# EAGLE schematic EMG (EAGLE 8.6.0)
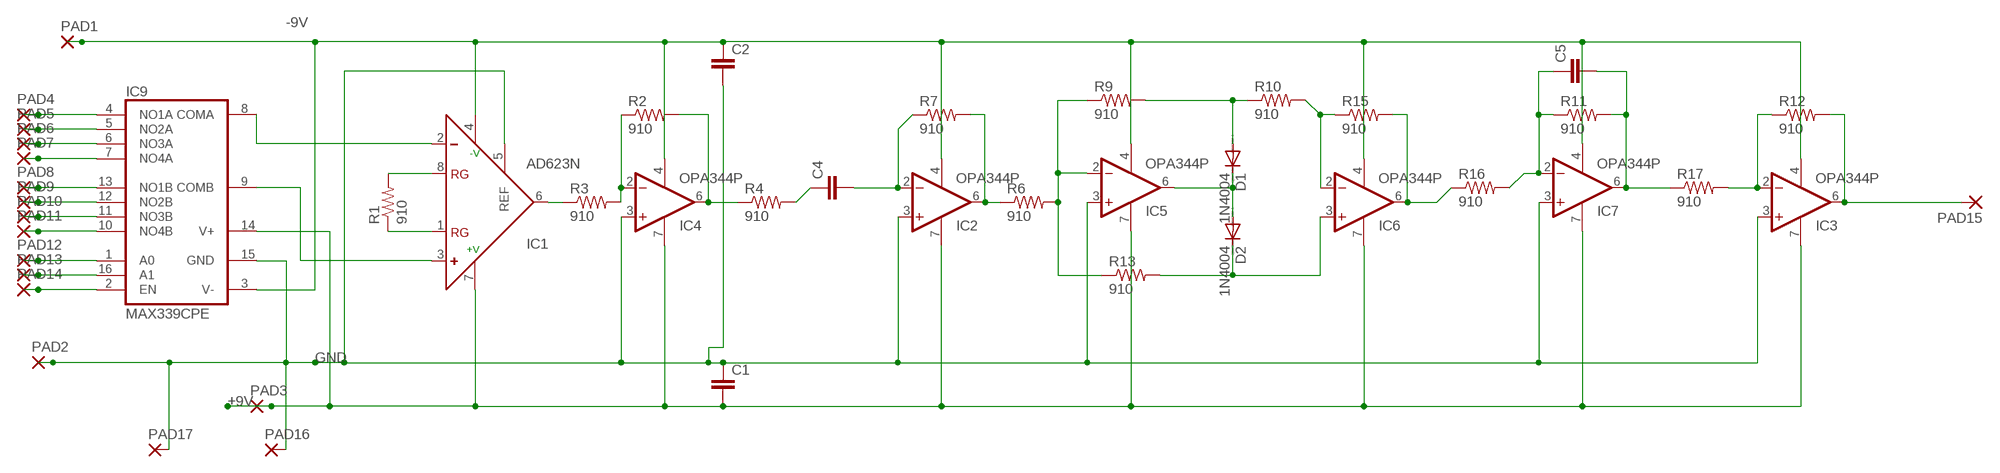
[diagram p0: schematic, sheet 1]

## Parts
C1  C2,5-3  [C2.5-3]
C2  C2,5-3  [C2.5-3]
C4  C2,5-3  [C2.5-3]
C5  C2,5-3  [C2.5-3]
D1  1N4004  [DO41-10]
D2  1N4004  [DO41-10]
IC1  AD623N  [DIL08]
IC2  OPA344P  [DIL08]
IC3  OPA344P  [DIL08]
IC4  OPA344P  [DIL08]
IC5  OPA344P  [DIL08]
IC6  OPA344P  [DIL08]
IC7  OPA344P  [DIL08]
IC9  MAX339CPE  [DIL16]
PAD1  1,6/0,8  [1,6/0,8]
PAD2  1,6/0,8  [1,6/0,8]
PAD3  1,6/0,8  [1,6/0,8]
PAD4  1,6/0,8  [1,6/0,8]
PAD5  1,6/0,8  [1,6/0,8]
PAD6  1,6/0,8  [1,6/0,8]
PAD7  1,6/0,8  [1,6/0,8]
PAD8  1,6/0,8  [1,6/0,8]
PAD9  1,6/0,8  [1,6/0,8]
PAD10  1,6/0,8  [1,6/0,8]
PAD11  1,6/0,8  [1,6/0,8]
PAD12  1,6/0,8  [1,6/0,8]
PAD13  1,6/0,8  [1,6/0,8]
PAD14  1,6/0,8  [1,6/0,8]
PAD15  1,6/0,8  [1,6/0,8]
PAD16  1,6/0,8  [1,6/0,8]
PAD17  1,6/0,8  [1,6/0,8]
R1  910  R-US_0204/7  [0204/7]
R2  910  R-US_0204/7  [0204/7]
R3  910  R-US_0204/7  [0204/7]
R4  910  R-US_0204/7  [0204/7]
R6  910  R-US_0204/7  [0204/7]
R7  910  R-US_0204/7  [0204/7]
R9  910  R-US_0204/7  [0204/7]
R10  910  R-US_0204/7  [0204/7]
R11  910  R-US_0204/7  [0204/7]
R12  910  R-US_0204/7  [0204/7]
R13  910  R-US_0204/7  [0204/7]
R15  910  R-US_0204/7  [0204/7]
R16  910  R-US_0204/7  [0204/7]
R17  910  R-US_0204/7  [0204/7]

## Nets
+9V: C1.2 IC1.7(+V) IC2.7(V+) IC3.7(V+) IC4.7(V+) IC5.7(V+) IC6.7(V+) IC7.7(V+) IC9.14(V+) PAD3.1(P)
-9V: C2.1 IC1.4(-V) IC2.4(V-) IC3.4(V-) IC4.4(V-) IC5.4(V-) IC6.4(V-) IC7.4(V-) IC9.3(V-) PAD1.1(P)
GND: C1.1 C2.2 IC1.5(REF) IC2.3(+IN) IC3.3(+IN) IC4.3(+IN) IC5.3(+IN) IC7.3(+IN) IC9.15(GND) PAD2.1(P) PAD16.1(P) PAD17.1(P)
N$1: IC1.8(RG) R1.2
N$2: IC1.1(RG) R1.1
N$3: IC1.6(OUT) R3.1
N$4: IC4.2(-IN) R2.1 R3.2
N$6: IC4.6(OUT) R2.2 R4.1
N$7: C4.1 R4.2
N$8: C4.2 IC2.2(-IN) R7.1
N$9: IC5.2(-IN) R6.2 R9.1 R13.1
N$10: D1.A R9.2 R10.1
N$11: IC2.6(OUT) R6.1 R7.2
N$12: IC6.6(OUT) R15.2 R16.1
N$13: C5.1 IC7.2(-IN) R11.1 R16.2
N$14: C5.2 IC7.6(OUT) R11.2 R17.1
N$15: IC3.2(-IN) R12.1 R17.2
N$16: IC3.6(OUT) PAD15.1(P) R12.2
N$17: D2.C IC6.3(+IN) R13.2
N$18: D1.C D2.A IC5.6(OUT)
N$19: IC6.2(-IN) R10.2 R15.1
N$20: IC1.2(-) IC9.8(COMA)
N$21: IC1.3(+) IC9.9(COMB)
N$22: IC9.10(NO4B) PAD11.1(P)
N$23: IC9.4(NO1A) PAD4.1(P)
N$24: IC9.5(NO2A) PAD5.1(P)
N$25: IC9.6(NO3A) PAD6.1(P)
N$26: IC9.7(NO4A) PAD7.1(P)
N$27: IC9.13(NO1B) PAD8.1(P)
N$28: IC9.11(NO3B) PAD10.1(P)
N$29: IC9.12(NO2B) PAD9.1(P)
N$30: IC9.1(A0) PAD12.1(P)
N$31: IC9.16(A1) PAD13.1(P)
N$32: IC9.2(EN) PAD14.1(P)

## Library data of the parts
C1 C2 C4 C5 = capacitor-wima:C: CAPACITOR naming: grid - package width
D1 D2 = diode:1N4004: DIODE general purpose rectifier, 1 A
IC1 = analog-devices:AD623: Single-Supply, Rail-to-Rail, Low Cost Instrumentation Amplifier Source: http://www.analog.com/static/imported-files/data_sheets/AD623.pdf; MF: ALTERA CORPORATION; MPN: AD623ANZ; OC_FARNELL: 9603700; OC_NEWARK: 59K4402
IC2-IC7 = linear:OPA*: Single Operational Amplifier Low Power, Single-Supply, Rail-To-Rail Operational Amplifier Source: http://focus.ti.com/lit/ds/symlink/opa2345.pdf
IC9 = maxim:MAX339CPE: MULTIPLEXER; MPN: MAX339CPE+; OC_FARNELL: unknown; OC_NEWARK: 05M8545
PAD1-PAD17 = wirepad:1,6/0,8: THROUGH-HOLE PAD
R1-R4 R6 R7 R9-R13 R15-R17 = rcl:R-US_: RESISTOR, American symbol; SPICEPREFIX: R